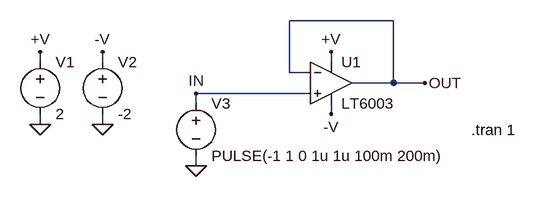
[diagram p0: schematic 6003.asc]
6003.asc, the LTspice schematic file:
Version 4
SHEET 1 880 756
WIRE 288 304 128 304
WIRE -256 368 -256 352
WIRE -160 368 -160 352
WIRE 192 368 192 352
WIRE 128 384 128 304
WIRE 160 384 128 384
WIRE 288 400 288 304
WIRE 288 400 224 400
WIRE 336 400 288 400
WIRE 160 416 -16 416
WIRE -16 432 -16 416
WIRE 192 448 192 432
WIRE -256 464 -256 448
WIRE -160 464 -160 448
WIRE -16 528 -16 512
FLAG -256 464 0
FLAG -160 464 0
FLAG -16 528 0
FLAG -16 416 IN
FLAG 336 400 OUT
FLAG 192 352 +V
FLAG -256 352 +V
FLAG -160 352 -V
FLAG 192 448 -V
SYMBOL voltage -256 352 R0
WINDOW 123 24 132 Left 2
WINDOW 39 0 0 Left 2
SYMATTR InstName V1
SYMATTR Value 2
SYMBOL voltage -160 352 R0
SYMATTR InstName V2
SYMATTR Value -2
SYMBOL voltage -16 416 R0
SYMATTR InstName V3
SYMATTR Value PULSE(-1 1 0 1u 1u 100m 200m)
SYMBOL LT6003 192 400 R0
SYMATTR InstName U1
TEXT 408 472 Left 2 !.tran 1

The netlist it stands for:
* 6003.asc
V1 +V 0 2
V2 -V 0 -2
V3 IN 0 PULSE(-1 1 0 1u 1u 100m 200m)
* U1: LT6003 (symbol LT6003 not available, pins judged from their places): In+=IN In-=OUT V+=+V V-=-V OUT=OUT
.tran 1
.backanno
.end